# Altium schematic sheet JR_main.SchDoc
size A4
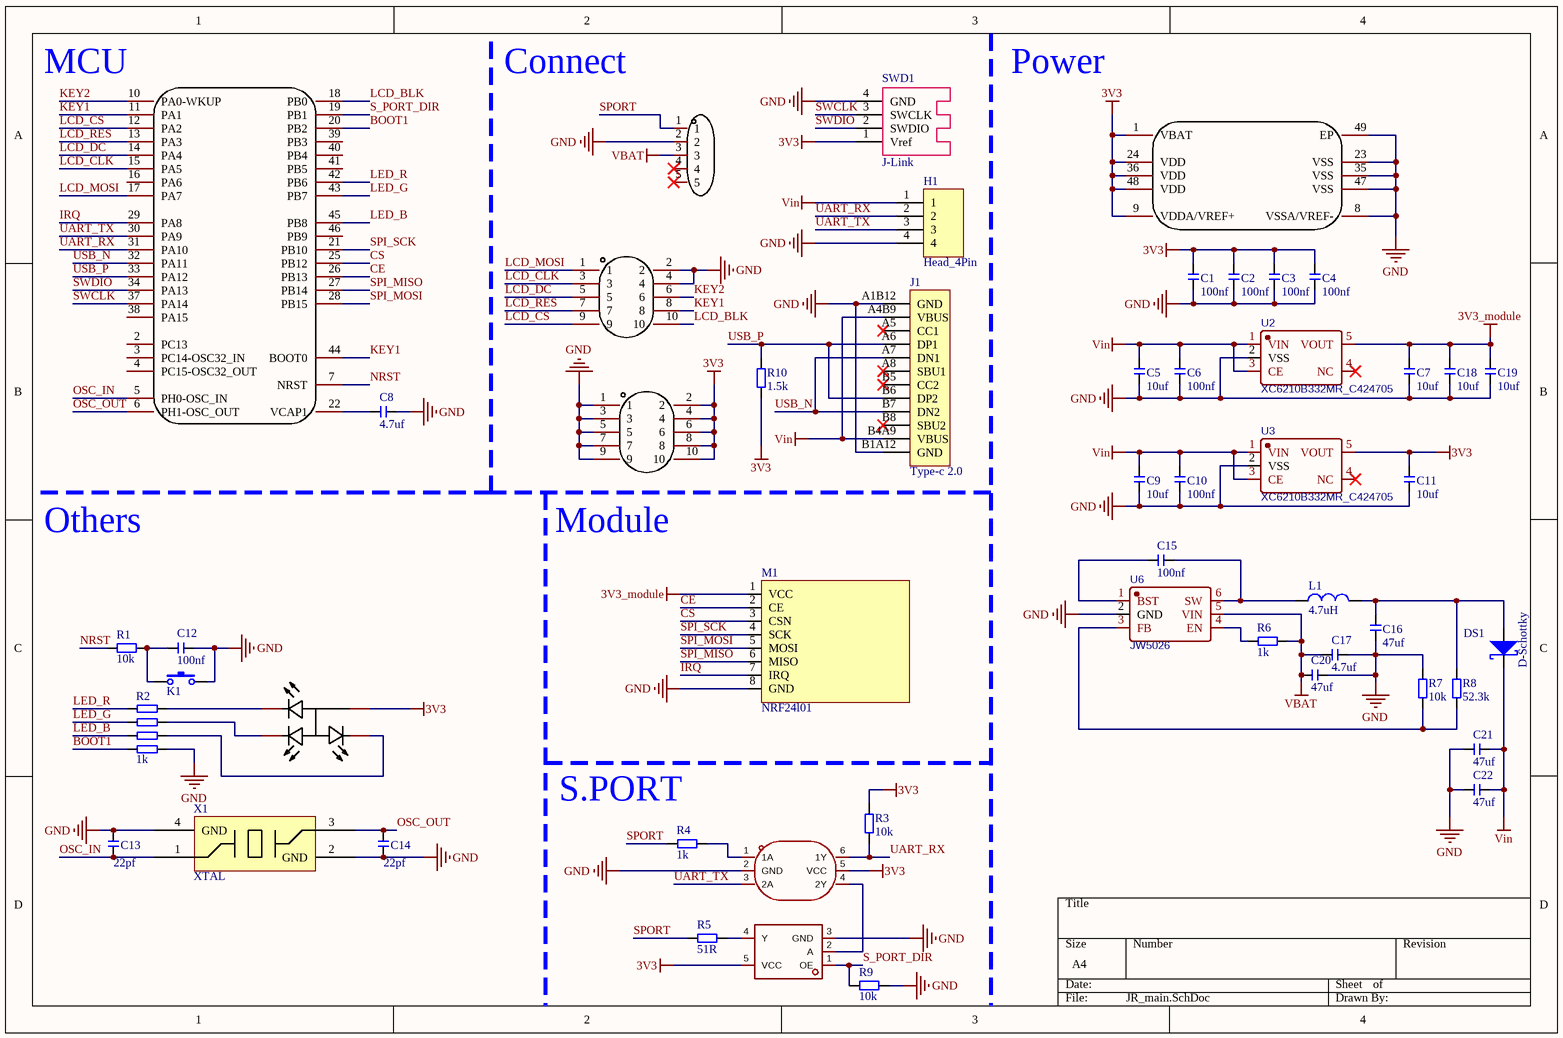
[diagram p0: JR_main.SchDoc]

## Parts
C1  100nf  [C0603]
C2  100nf  [C0603]
C3  100nf  [C0603]
C4  100nf  [C0603]
C5  10uf  [C0603]
C6  100nf  [C0603]
C7  10uf  [C0603]
C8  4.7uf  [C0603]
C9  10uf  [C0603]
C10  100nf  [C0603]
C11  10uf  [C0603]
C12  100nf  [C0603]
C13  22pf  [C0603]
C14  22pf  [C0603]
C15  100nf  [C0603]
C16  47uf  [C0603]
C17  4.7uf  [C0603]
C18  10uf  [C0603]
C19  10uf  [C0603]
C20  47uf  [C1206]
C21  47uf  [C1206]
C22  47uf  [C1206]
CN1  B2541BW-5P  [CONN-TH_B2541BW-5P]  (value not drawn)
DS1  D-Schottky  [SMA]
H1  Head_4Pin  [1.27排针_4PIN]
J1  Type-c 2.0  [TYPE-C16PIN]
K1  Key-PB  [SW_4.2x3.2]  (value not drawn)
L1  4.7uH  [L-4020]
LED1  E6C0606RGBC3UDA  [LED-SMD_4P-L1.6-W1.6-TL-FD]  (value not drawn)
M1  NRF24l01  [NRF24l01]
R1  10k  [R0603]
R2  1k  [0402*4]
R3  10k  [RES0603]
R4  1k  [RES0603]
R5  51R  [RES0603]
R6  1k  [R0603]
R7  10k  [R0603]
R8  52.3k  [R0603]
R9  10k  [RES0603]
R10  1.5k  [R0603]
SWD1  J-Link  [1.27 排针 4p]
U1  STM32F401CCU6  [UFQFPN-48_L7.0-W7.0-P0.50-BL-EP]  (value not drawn)  (parts A,B of 2)
U2  XC6210B332MR_C424705  [SOT-25_L3.0-W1.6-P0.95-LS2.8-BL]
U3  XC6210B332MR_C424705  [SOT-25_L3.0-W1.6-P0.95-LS2.8-BL]
U4  2343U-205CNG1SNT01  [HDR-TH_10P-P1.27-V-F-R2-C5-S1.27-1]  (value not drawn)
U5  2343U-205CNG1SNT01  [HDR-TH_10P-P1.27-V-F-R2-C5-S1.27-1]  (value not drawn)
U6  JW5026  [SOT-23-6_L2.9-W1.6-P0.95-LS2.8-BR - duplicate]
U7  SN74LVC2G04DBVR  [SOT-23-6]  (value not drawn)
U8  SN74LVC1G126DBVR  [SOT-23-5]  (value not drawn)
X1  XTAL  [OSC_KH3225_4P]

## Nets
3V3: C1.2 C2.2 C3.2 C4.2 C11.2 LED1.2(+) R3.2 R10.1 SWD1.1(Vref) U1.1(VBAT) U1.9(VDDA/VREF+) U1.24(VDD) U1.36(VDD) U1.48(VDD) U3.5(VOUT) U4.2 U4.4 U4.6 U4.8 U4.10 U7.5(VCC) U8.5(VCC)
3V3_module: C7.2 C18.2 C19.2 M1.1(VCC) U2.5(VOUT)
GND: C1.1 C2.1 C3.1 C4.1 C5.2 C6.1 C7.1 C8.2 C9.2 C10.1 C11.1 C12.1 C13.2 C14.1 C16.1 C17.1 C18.1 C19.1 C20.1 C21.2 C22.2 CN1.2 H1.4 J1.A1B12(GND) J1.B1A12(GND) K1.2 M1.8(GND) R2.5 R7.2 R9.1 SWD1.4(GND) U1.8(VSSA/VREF-) U1.23(VSS) U1.35(VSS) U1.47(VSS) U1.49(EP) U2.2(VSS) U3.2(VSS) U4.1 U4.3 U4.5 U4.7 U4.9 U5.2 U5.4 U6.2(GND) U7.2(GND) U8.3(GND) X1.2(GND) X1.4(GND)
VBAT: C17.2 C20.2 CN1.3 R6.2 U6.5(VIN)
Vin: C5.1 C6.2 C9.1 C10.2 C21.1 C22.1 DS1.2 H1.1 J1.A4B9(VBUS) J1.B4A9(VBUS) U2.1(VIN) U2.3(CE) U3.1(VIN) U3.3(CE)
BOOT1: R2.4 U1.20(PB2)
CE: M1.2(CE) U1.26(PB13)
CS: M1.3(CSN) U1.25(PB12)
IRQ: M1.7(IRQ) U1.29(PA8)
KEY1: U1.11(PA1) U1.44(BOOT0) U5.8
KEY2: U1.10(PA0-WKUP) U5.6
LCD_BLK: U1.18(PB0) U5.10
LCD_CLK: U1.15(PA5) U5.3
LCD_CS: U1.12(PA2) U5.9
LCD_DC: U1.14(PA4) U5.5
LCD_MOSI: U1.17(PA7) U5.1
LCD_RES: U1.13(PA3) U5.7
LED_B: R2.3 U1.45(PB8)
LED_G: R2.2 U1.43(PB7)
LED_R: R2.1 U1.42(PB6)
NRST: R1.1 U1.7(NRST)
OSC_IN: C13.1 U1.5(PH0-OSC_IN) X1.1(OSC1)
OSC_OUT: C14.2 U1.6(PH1-OSC_OUT) X1.3(OSC2)
S_PORT_DIR: R9.2 U1.19(PB1) U8.1(OE)
SPI_MISO: M1.6(MISO) U1.27(PB14)
SPI_MOSI: M1.5(MOSI) U1.28(PB15)
SPI_SCK: M1.4(SCK) U1.21(PB10)
SPORT: CN1.1 R4.2 R5.2
SWCLK: SWD1.3(SWCLK) U1.37(PA14)
SWDIO: SWD1.2(SWDIO) U1.34(PA13)
UART_RX: H1.2 R3.1 U1.31(PA10) U7.6(1Y)
UART_TX: H1.3 U1.30(PA9) U7.3(2A)
USB_N: J1.A7(DN1) J1.B7(DN2) U1.32(PA11)
USB_P: J1.A6(DP1) J1.B6(DP2) R10.2 U1.33(PA12)
NetC8_1: C8.1 U1.22(VCAP1)
NetC12_2: C12.2 K1.1 R1.2
NetC15_1: C15.1 U6.1(BST)
NetC15_2: C15.2 L1.1 U6.6(SW)
NetC16_2: C16.2 DS1.1 L1.2 R8.2
NetLED1_1: LED1.1(-) R2.8
NetLED1_3: LED1.3(-) R2.7
NetLED1_4: LED1.4(-) R2.6
NetR4_1: R4.1 U7.1(1A)
NetR5_1: R5.1 U8.4(Y)
NetR6_1: R6.1 U6.4(EN)
NetR7_1: R7.1 R8.1 U6.3(FB)
NetU7_4: U7.4(2Y) U8.2(A)

Not connected (* = marked no-connect by the designer): CN1 4* 5*; J1 A5(CC1)* A8(SBU1)* B5(CC2)* B8(SBU2)*; U1 2(PC13) 3(PC14-OSC32_IN) 4(PC15-OSC32_OUT) 16(PA6) 38(PA15) 39(PB3) 40(PB4) 41(PB5) 46(PB9); U2 4(NC)*; U3 4(NC)*

## Notes on the sheet
- (near U1) MCU
- Connect
- Power
- Others
- (near U4) Module
- (near R4) S.PORT

## Library data of the parts
C1-C22 = CAP: 无极电容; accuracy: 20%
  C1-C4 C6 C10 C12 C15: value: 100nf
  C5 C7 C9 C11 C18 C19: value: 10uf
  C8 C17: value: 4.7uf
  C13 C14: value: 22pf
  C16 C20-C22: value: 47uf
CN1 = B2541BW-5P: Manufacturer: CJT(长江连接器); Add into BOM: yes; Pitch: 2.54mm; Pins Structure: 1x5P; Number of PINs Per Row: 5; Name: B2541BW-5P; Symbol: B2541BW-5P; Device: B2541BW-5P; LCSC Part Name: B2541BW-5P; Supplier Part: C339791; Manufacturer Part: B2541BW-5P; Supplier Footprint: 插件,P=2.5mm; JLCPCB Part Class: Extended Part; Datasheet: https://atta.szlcsc.com/upload/public/pdf/watermark/20190926/C339791_B20238F2CD55658633FCD511B58CAA6D.pdf; Supplier: LCSC; Convert to PCB: yes; Reference Series: -; Number of Rows: 1; Row Spacing: -; Mounting Style: -; Contact Material: 磷青铜
DS1 = Diode-Schottky: 肖特基二极管
J1 = Type-c 2.0: Type-c座子
K1 = Key-PB: 轻触开关
L1 = Lnd: 电感
LED1 = E6C0606RGBC3UDA: Manufacturer: ekinglux(亿晶源); Add into BOM: yes; Emitted Color: RGB三色; Name: E6C0606RGBC3UDA; Symbol: E6C0606RGBC3UDA; Device: E6C0606RGBC3UDA; LCSC Part Name: RGB三色; Supplier Part: C375569; Manufacturer Part: E6C0606RGBC3UDA; Supplier Footprint: SMD,1.6x1.6x0.6mm; JLCPCB Part Class: Extended Part; Datasheet: https://atta.szlcsc.com/upload/public/pdf/source/20220330/8DE12FB9881A833E867FD7AF6894B416.pdf; Supplier: LCSC; Convert to PCB: yes
R1 R6-R8 R10 = RES: 电阻
  R1 R7: Value: 10k
  R6: Value: 1k
  R8: Value: 52.3k
  R10: Value: 1.5k
R2 = 排阻: Value: 1k
R3-R5 R9 = Res: 电阻
  R3 R9: value: 10k
  R4: value: 1k
  R5: value: 51R
SWD1 = Comm_SWD: 调试接口_SWD
U1 = STM32F401CCU6: Manufacturer: ST(意法半导体); Add into BOM: yes; Speed: 84MHz; Voltage - Supply (Vcc/Vdd): 1.7V ~ 3.6V; Program Memory Size: 256KB; RAM Size: 64KB; Number of I/O: 36; A/D: 10x12bit; PWM: 32; UART/USART: 3 USART; SPI: 3; USB Device: 1; Name: STM32F401CCU6; Symbol: STM32F401CCU6; Device: STM32F401CCU6; LCSC Part Name: STM32F401CCU6; Supplier Part: C79861; Manufacturer Part: STM32F401CCU6; Supplier Footprint: UFQFPN-48; JLCPCB Part Class: Extended Part; Datasheet: https://atta.szlcsc.com/upload/public/pdf/source/20160816/1471343009422.pdf; Supplier: LCSC; Convert to PCB: yes; I2C（SMBUS/PMBUS）: 3; USB Host/OTG: 1
U2 U3 = XC6210B332MR_C424705: 3.3V稳压芯片; BOM_Manufacturer: Torex Semicon; Contributor: LCSC; BOM_Supplier: LCSC; BOM_Supplier Part: C424705; BOM_Manufacturer Part: XC6210B332MR; BOM_JLCPCB Part Class: Extended Part; spicePre: U; spiceSymbolName: XC6210B332MR_C424705
U4 U5 = 1.27排针 2*5P: Manufacturer: 华宇创; Add into BOM: yes; Pitch: 1.27mm; Number of Holes: 10; Holes Structure: 2x5P; Name: 2343U-205CNG1SNT01; Symbol: 2343U-205CNG1SNT01; Device: 2343U-205CNG1SNT01; LCSC Part Name: 1.27mm 2x5P U型/环保耐高温/镀金; Supplier Part: C350287; Manufacturer Part: 2343U-205CNG1SNT01; Supplier Footprint: 插件,P=1.27mm; JLCPCB Part Class: Extended Part; Datasheet: https://atta.szlcsc.com/upload/public/pdf/source/20181220/C350287_D742F1AEC20B5CCE37A83D869655120C.pdf; Supplier: LCSC; Convert to PCB: yes; Number of Rows: 2; Row Spacing: 1.27mm; Mounting Type: 直插; Insulation Height: -; Contact Material: 磷青铜; Contact Plating: -
U6 = JW5026: 小尺寸降压芯片; BOM_Manufacturer: JoulWatt Tech; Contributor: LCSC; BOM_Supplier: LCSC; BOM_Supplier Part: C185109; BOM_Manufacturer Part: JW5026; BOM_JLCPCB Part Class: Extended Part; spicePre: U; spiceSymbolName: JW5026
U7 = SN74LVC2G04DBVR: 反相器; Symbol: SN74LVC2G04DBVR
U8 = SN74LVC1G126DBVR: 三态输出缓存器; Symbol: SN74LVC1G126DBVR
X1 = XTAL_贴片: 无源晶振